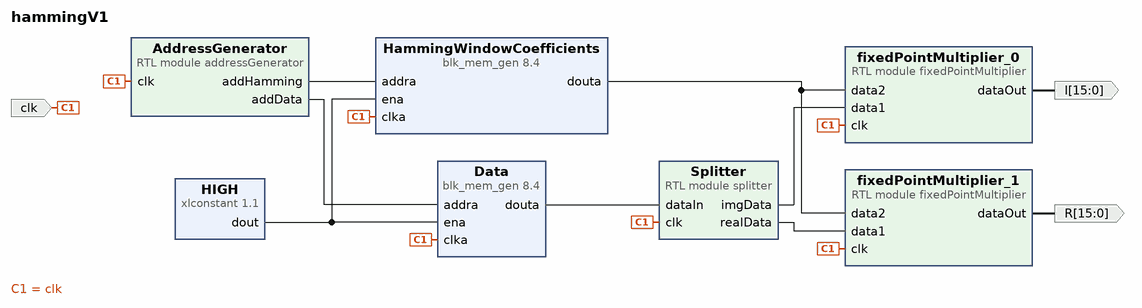
[diagram p0: block diagram of the top level]
# Vivado block design hammingV1, xc7z020clg484-1, Vivado 2020.2
create_bd_design hammingV1

create_bd_port -dir I -type clk clk
create_bd_port -dir O -from 15 -to 0 -type data R
create_bd_port -dir O -from 15 -to 0 -type data I

create_bd_cell -type ip -vlnv xilinx.com:ip:blk_mem_gen:8.4 Data
set_property -dict [list \
  CONFIG.Coe_File ../../../../../../ExternalFiles/data.coe \
  CONFIG.Enable_32bit_Address false \
  CONFIG.Load_Init_File true \
  CONFIG.Register_PortA_Output_of_Memory_Primitives true \
  CONFIG.Use_Byte_Write_Enable false \
  CONFIG.Use_RSTA_Pin false \
  CONFIG.Write_Depth_A 12520 \
  CONFIG.use_bram_block Stand_Alone \
] [get_bd_cells Data]
create_bd_cell -type ip -vlnv xilinx.com:ip:xlconstant:1.1 HIGH
create_bd_cell -type ip -vlnv xilinx.com:ip:blk_mem_gen:8.4 HammingWindowCoefficients
set_property -dict [list \
  CONFIG.Coe_File ../../../../../../ExternalFiles/hamming.coe \
  CONFIG.Enable_32bit_Address false \
  CONFIG.Load_Init_File true \
  CONFIG.Read_Width_A 16 \
  CONFIG.Register_PortA_Output_of_Memory_Primitives true \
  CONFIG.Use_Byte_Write_Enable false \
  CONFIG.Use_RSTA_Pin false \
  CONFIG.Write_Depth_A 40 \
  CONFIG.Write_Width_A 16 \
  CONFIG.use_bram_block Stand_Alone \
] [get_bd_cells HammingWindowCoefficients]
create_bd_cell -type module -reference addressGenerator AddressGenerator
create_bd_cell -type module -reference fixedPointMultiplier fixedPointMultiplier_0
create_bd_cell -type module -reference fixedPointMultiplier fixedPointMultiplier_1
create_bd_cell -type module -reference splitter Splitter

# ---- connections ----

connect_bd_net -net addressGenerator_0_address [get_bd_pins AddressGenerator/addData] [get_bd_pins Data/addra]
connect_bd_net -net clk_0_1 [get_bd_ports clk] \
  [get_bd_pins Data/clka] [get_bd_pins HammingWindowCoefficients/clka] [get_bd_pins AddressGenerator/clk] \
  [get_bd_pins fixedPointMultiplier_0/clk] [get_bd_pins fixedPointMultiplier_1/clk] [get_bd_pins Splitter/clk]
connect_bd_net [get_bd_pins HIGH/dout] [get_bd_pins Data/ena] [get_bd_pins HammingWindowCoefficients/ena]
connect_bd_net [get_bd_pins AddressGenerator/addHamming] [get_bd_pins HammingWindowCoefficients/addra]
connect_bd_net [get_bd_pins Data/douta] [get_bd_pins Splitter/dataIn]
connect_bd_net [get_bd_pins Splitter/realData] [get_bd_pins fixedPointMultiplier_1/data1]
connect_bd_net [get_bd_pins Splitter/imgData] [get_bd_pins fixedPointMultiplier_0/data1]
connect_bd_net [get_bd_pins HammingWindowCoefficients/douta] [get_bd_pins fixedPointMultiplier_0/data2] [get_bd_pins fixedPointMultiplier_1/data2]
connect_bd_net [get_bd_pins fixedPointMultiplier_1/dataOut] [get_bd_ports R]
connect_bd_net [get_bd_pins fixedPointMultiplier_0/dataOut] [get_bd_ports I]

validate_bd_design
save_bd_design
